# Altium schematic sheet DC-DC_Buck_Converter+12Vto+3.3V.SchDoc
size A4; SheetNumber: 3; SheetTotal: 10
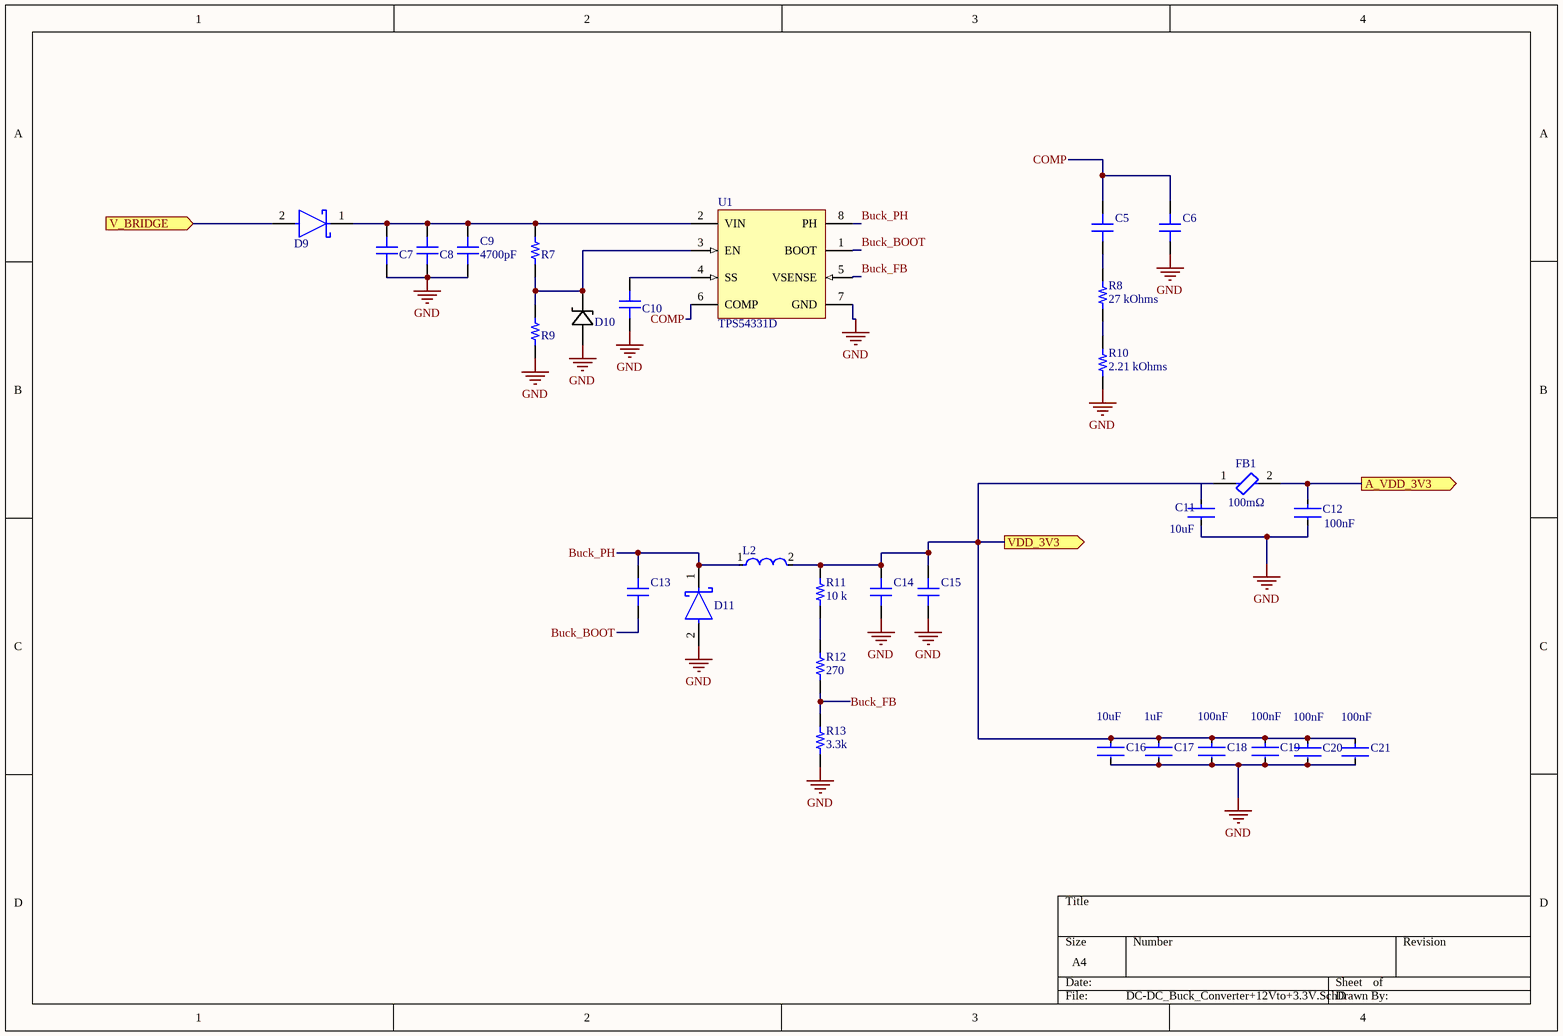
[diagram p0: DC-DC_Buck_Converter+12Vto+3.3V.SchDoc]

## Parts
C5  4700pF  [CAP 0603_1608]  (value not drawn)
C6  4700pF  [CAP 0603_1608]  (value not drawn)
C7  4700pF  [CAP 0603_1608]  (value not drawn)
C8  4700pF  [CAP 0603_1608]  (value not drawn)
C9  4700pF  [CAP 0603_1608]
C10  4700pF  [CAP 0603_1608]  (value not drawn)
C11  Capacitance: 10uF  [FP-GRM188-0_1-e0_2_0_55-IPC_A]  (hidden comment: GRM188R60J106ME47D)
C12  Capacitance: 100nF  [FP-GRM033-0_03-MFG]  (hidden comment: GRM033R60J104KE19D)
C13  1000pF  [CAP 0603_1608]  (value not drawn)
C14  1000pF  [CAP 0603_1608]  (value not drawn)
C15  1000pF  [CAP 0603_1608]  (value not drawn)
C16  Capacitance: 10uF  [FP-GRM188-0_1-e0_2_0_55-IPC_A]  (hidden comment: GRM188R60J106ME47D)
C17  value 1uF  [FP-GRM15-0_1-MFG]  (hidden comment: GRM155R61A105KE15D)
C18  Capacitance: 100nF  [FP-GRM033-0_03-MFG]  (hidden comment: GRM033R60J104KE19D)
C19  Capacitance: 100nF  [FP-GRM033-0_03-MFG]  (hidden comment: GRM033R60J104KE19D)
C20  Capacitance: 100nF  [FP-GRM033-0_03-MFG]  (hidden comment: GRM033R60J104KE19D)
C21  Capacitance: 100nF  [FP-GRM033-0_03-MFG]  (hidden comment: GRM033R60J104KE19D)
D9  SS34-E3/57T  [FP-95402-MFG]  (value not drawn)
D10  zmm3v3  [zmm5v6]  (value not drawn)
D11  SS34-E3/57T  [FP-95402-MFG]  (value not drawn)
FB1  Resistance: 100mΩ  [FP-MPZ2012-MFG]  (hidden comment: MPZ2012S601AT000)
L2  IHLP2525CZER6R8M01  [FP-IHLP-2525CZ-FP_2_413x3-MFG]  (value not drawn)
R7  15 kOhms  [RES 0805_2012]  (value not drawn)
R8  27 kOhms  [RES 0805_2012]
R9  15 kOhms  [RES 0805_2012]  (value not drawn)
R10  2.21 kOhms  [RES 0805_2012]
R11  10 k  [RES 0805_2012]
R12  270  [RES 0805_2012]
R13  3.3k  [RES 0805_2012]
U1  TPS54331D  [D0008A_L]

## Ports
A_VDD_3V3 (out, see MCU[1B]), V_BRIDGE (in, see DC_Current_Voltage_Measurement[3B], MotorDrivers[3C], Motors[1A], Power[4A]), VDD_3V3 (out, see ADC_Input_protection[3C], DC_Current_Voltage_Measurement[3B], MCU[1B], MotorDrivers[1A], MotorDrivers[1B], Power[1D], ZeroCrossing[1A])

## Nets
GND: C6.1 C7.1 C8.1 C9.1 C10.1 C11.2 C12.2 C14.2 C15.2 C16.2 C17.2 C18.2 C19.2 C20.2 C21.2 D10.2(ANODE) D11.2(A) R9.1 R10.1 R13.1 U1.7(GND)
A_VDD_3V3: C12.1 FB1.2 ; port A_VDD_3V3
Buck_BOOT: C13.2 U1.1(BOOT)
Buck_FB: R12.1 R13.2 U1.5(VSENSE)
Buck_PH: C13.1 D11.1(C) L2.1 U1.8(PH)
COMP: C5.2 C6.2 U1.6(COMP)
V_BRIDGE: D9.2(A) ; port V_BRIDGE
VDD_3V3: C11.1 C14.1 C15.1 C16.1 C17.1 C18.1 C19.1 C20.1 C21.1 FB1.1 L2.2 R11.2 ; port VDD_3V3
NetC5_1: C5.1 R8.2
NetC7_2: C7.2 C8.2 C9.2 D9.1(C) R7.2 U1.2(VIN)
NetC10_2: C10.2 U1.4(SS)
NetD10_1: D10.1(CATHODE) R7.1 R9.2 U1.3(EN)
NetR8_1: R8.1 R10.2
NetR11_1: R11.1 R12.2

## Library data of the parts
C5-C10 = 06035C472JAT2A: CAP CER 4700PF 50V X7R 0603; manufacturer: AVX Corporation; Tolerance: ±5%; Part Number: 06035C472JAT2A; Value: 4700pF; Applications: General Purpose; Capacitance: 4700pF; componentlink1description: Datasheet; componentlink1url: http://datasheets.avx.com/X7RDielectric.pdf; componentlink2description: DigiKey Link; componentlink2url: http://digikey.com/product-detail/en/avx-corporation/06035C472JAT2A/478-10355-1-ND/6797516; Device Package: 0603 (1608 Metric); lastupdated: 2.09.2020 01:03:35; Lifecycle Status: Active; Minimum Order: 1; Mounting Type: Surface Mount, MLCC; Operating Temperature: -55°C ~ 125°C; Package / Case: 0603 (1608 Metric); packaging: TapeAndReel; partid: 2778; Part Status: Active; price: 0.02; series: -; Size / Dimension: 0.063" L x 0.032" W (1.60mm x 0.81mm); Supplier 1: DigiKey; Supplier Part Number 1: 478-10355-1-ND; Temperature Coefficient: X7R; Thickness (Max): 0.035" (0.90mm); Voltage - Rated: 50V
C11 C16 = CMP-2006-02792-2: Chip Multilayer Ceramic Capacitors for General Purpose, 0603, 10uF, X5R, 15%, 20%, 6.3V; Packaging: Tape and Reel; Voltage Rating (DC): 6.3V; Width: 0.031inch; Termination: SMD/SMT; Dielectric: X5R; Package Quantity: 4000; Voltage Rating: 6.3V; Case/Package: 0603; Min Operating Temperature: -55°C; Voltage: 6.3V; Length: 1.6mm; Thickness: 0.035inch; Lead Free: Lead Free; Depth: 0.8mm; Case Code (Imperial): 0603; Max Operating Temperature: 85°C; Material: Ceramic; Height: 0.8mm; Tolerance: 20%; Mount: Surface Mount; REACH SVHC: No SVHC; Radiation Hardening: No; Case Code (Metric): 1608
C12 C18-C21 = CMP-06035-000062-2: Chip Multilayer Ceramic Capacitors for General Purpose, 0201, 0.10uF, X5R, 15%, 10%, 6.3V; Min Operating Temperature: -55°C; Lead Free: Lead Free; Radiation Hardening: No; Dielectric: X5R; Voltage Rating (DC): 6.3V; REACH SVHC: No SVHC; Case/Package: 0201; Voltage Rating: 6.3V; Length: 0.6mm; Max Operating Temperature: 85°C; Width: 0.012inch; Depth: 0.3mm; Material: Ceramic; Case Code (Metric): 0603; Thickness: 0.013inch; Packaging: Tape and Reel; Height: 0.3mm; Weight: 6E-06oz; Package Quantity: 1; Mount: Surface Mount; Voltage: 6.3V; Case Code (Imperial): 0201; Tolerance: 10%; Termination: SMD/SMT
C13-C15 = 0603ZC102KAT2A: CAP CER 1000PF 10V X7R 0603; manufacturer: AVX Corporation; Tolerance: ±10%; Part Number: 0603ZC102KAT2A; Value: 1000pF; Applications: General Purpose; Capacitance: 1000pF; componentlink1description: Datasheet; componentlink1url: http://datasheets.avx.com/X7RDielectric.pdf; componentlink2description: DigiKey Link; componentlink2url: http://digikey.com/product-detail/en/avx-corporation/0603ZC102KAT2A/478-0603ZC102KAT2ACT-ND/11570315; Device Package: 0603 (1608 Metric); lastupdated: 2.09.2020 01:02:55; Lifecycle Status: Active; Minimum Order: 1; Mounting Type: Surface Mount, MLCC; Operating Temperature: -55°C ~ 125°C; Package / Case: 0603 (1608 Metric); packaging: TapeAndReel; partid: 27370; Part Status: Active; price: 0.01; series: -; Supplier 1: DigiKey; Supplier Part Number 1: 478-0603ZC102KAT2ACT-ND; Temperature Coefficient: X7R; Voltage - Rated: 10V
C17 = CMP-2008-04556-2: CAP CER 1UF 10V X5R 0402; Manufacturer: Murata; Material: Ceramic; Tolerance: 10%; Temperature Coefficient: 15%; Octopart: https://octopart.com/grm155r61a105ke15d-murata-197442; Manufacturer Part Number: GRM155R61A105KE15D; Lead Free: Yes; ComponentLink2Description: Datasheet; Temperature: -55°C to +85°C; Temperature Range High: +85°C; Height: 0.55mm; Capacitance: 1uF; Ipc Land Pattern Name: CAPC10050X50; ComponentLink2URL: https://search.murata.co.jp/Ceramy/image/img/A01X/G101/ENG/GRM155R61A105KE15-01A.pdf; Temperature Range Low: -55°C; Device Class L2: Capacitors; Voltage Rating: 10V; RoHS: TRUE; Device Class L1: Passive Components; Device Class L3: Ceramic Capacitors; Temperature Characteristic: X5R; Mouser Description: 0402 1 uF 10 V ±10% Tolerance X5R Surface Mount Multilayer Ceramic Capacitor; Automotive: No; Package: GRM15-0.1; Digikey Description: CAP CER 1UF 10V X5R 0402; Category: Cap
D9 D11 = CMP-02539-000012-1: DIODE SCHOTTKY 40V 3A DO214AB; Manufacturer: Vishay; Max Junction Temp: +150°C; Peak Reverse Current: 0.5mA; Max Surge Forward Current: 100A; Standoff Height: 0mm; ComponentLink2Description: Datasheet; Device Class L3: Schottky Diodes; Height: 2.62mm; Max Repetitive Reverse Voltage: 40V; Lead Free: Yes; Package: 95402; Temperature Range High: +150°C; ComponentLink2URL: http://www.vishay.com/docs/88751/ss32.pdf; Temperature: -55°C to +150°C; Footprint Url: http://www.vishay.com/docs/95402/smc.pdf; Automotive: No; Forward Current: 3A; Category: Diode; Manufacturer Part Number: SS34-E3/57T; RoHS: TRUE; Device Class L2: Diodes; Mouser Description: Schottky Diodes & Rectifiers 3.0 Amp 40 Volt; Octopart: https://octopart.com/ss34-e3%2F57t-vishay-39552907; Temperature Range Low: -55°C; Device Class L1: Discrete Semiconductors; Digikey Description: DIODE SCHOTTKY 40V 3A DO214AB
D10 = zmm5v6
FB1 = CMP-2000-05401-2: Manufacturer Lifecycle Status: PRODUCTION; NexarPartId: 12090955; RMS Current (Irms): 2A; Test Frequency: 100MHz; Tolerance: 25%; Core Material: Ferrite; Impedance: 600Ω; Packaging: Digi-Reel®; Length: 2mm; Min Operating Temperature: -55°C; Width: 1.25mm; Max Width: 1.45mm; Lead Free: Lead Free; Current Rating: 2A; Case Code (Imperial): 0805; Min Length: 1.8mm; Schedule B: 8504500000, 8504500000; Series Resistance: 100mΩ; REACH SVHC: No SVHC; Case Code (Metric): 2012; Max DC Current: 2A; Case/Package: 0805; Lifecycle Status: Production; Min Width: 1.05mm; Mount: Surface Mount; Height: 1.0414mm; DC Resistance (DCR): 100mΩ; Max Operating Temperature: 125°C; Max Length: 2.2mm; RoHS: Compliant
L2 = CMP-02424-000104-1: Commercial Inductors, High Saturation Series 6.8uH 4.5A 60mΩ 20%; Saturation Current: 8A; Self Resonant Frequency: 5MHz; Core Material: Metal; DC Resistance (DCR): 60mR; Test Frequency: 100kHz; Shielding: Shielded; Number of Pins: 2; Tolerance: 20%; Max DC Current: 8A; Max Operating Temperature: 125°C; Radiation Hardening: No; Inductance: 6.8uH; Contact Plating: Tin; RMS Current (Irms): 4.5A; Case/Package: 2525; Inductance Tolerance: 20%; Case Code (Metric): 6363; Lead Free: Lead Free; Package Quantity: 2000; Current Rating: 4.5A; Case Code (Imperial): 2525; Height - Seated (Max): 0.118inch; Height: 3mm; Mount: Surface Mount; Depth: 6.72mm; Military Standard: Not; Packaging: Tape and Reel; Min Operating Temperature: -55°C; Width: 0.255inch; Length: 7.24mm; Termination: SMD/SMT
R7 R9 = PTN0805Y1502BST1: PTN0805 10PPM 15K 0.1% S T1 E1; Manufacturer: Vishay Dale Thin Film; Power (Watts): 0.2W, 1/5W; Temperature Coefficient: ±10ppm/°C; Part Number: PTN0805Y1502BST1; Value: 15 kOhms; ComponentLink1Description: Datasheet; ComponentLink1URL: https://www.vishay.com/docs/60026/ptn.pdf; ComponentLink2Description: DigiKey Link; ComponentLink2URL: https://www.digikey.com/en/products/detail/vishay-dale-thin-film/PTN0805Y1502BST1/12820709; Composition: Thin Film; Device Package: 0805 (2012 Metric); Features: Anti-Sulfur, Moisture Resistant, Non-Inductive; Height - Seated (Max): 0.033" (0.84mm); LastUpdated: 3.10.2023 19:53:28; Lifecycle Status: Active; Minimum Order: 1; Number of Terminations: 2; Operating Temperature: -55°C ~ 155°C; Package / Case: 0805 (2012 Metric); Packaging: TapeAndReel; PartId: 61260; Part Status: Active; Price: 0.29; Resistance: 15 kOhms; Series: PTN; Size / Dimension: 0.080" L x 0.050" W (2.03mm x 1.27mm); Supplier 1: DigiKey; Supplier Part Number 1: 764-PTN0805Y1502BST1CT-ND; Supplier Device Package: 0805; Tolerance: ±0.1%
R8 = RMCF0805FT27K0: RES 27K OHM 1% 1/8W 0805; Manufacturer: Stackpole Electronics Inc; Power (Watts): 0.125W, 1/8W; Temperature Coefficient: ±100ppm/°C; Part Number: RMCF0805FT27K0; Value: 27 kOhms; ComponentLink1Description: Datasheet; ComponentLink1URL: https://www.seielect.com/catalog/sei-packaging.pdf; ComponentLink2Description: DigiKey Link; ComponentLink2URL: https://www.digikey.com/en/products/detail/stackpole-electronics-inc/RMCF0805FT27K0/1712930; Composition: Thick Film; Device Package: 0805 (2012 Metric); Features: Automotive AEC-Q200; Height - Seated (Max): 0.026" (0.65mm); LastUpdated: 3.10.2023 19:54:39; Lifecycle Status: Active; Minimum Order: 1; Number of Terminations: 2; Operating Temperature: -55°C ~ 155°C; Package / Case: 0805 (2012 Metric); Packaging: CutTape; PartId: 38336; Part Status: Active; Price: 0.01; Ratings: AEC-Q200; Resistance: 27 kOhms; Series: RMCF; Size / Dimension: 0.079" L x 0.049" W (2.00mm x 1.25mm); Supplier 1: DigiKey; Supplier Part Number 1: RMCF0805FT27K0CT-ND; Supplier Device Package: 0805; Tolerance: ±1%
R10 = RMCF0805FG2K21: RES 2.21K OHM 1% 1/8W 0805; Manufacturer: Stackpole Electronics Inc; Power (Watts): 0.125W, 1/8W; Temperature Coefficient: ±100ppm/°C; Part Number: RMCF0805FG2K21; Value: 2.21 kOhms; ComponentLink1Description: Datasheet; ComponentLink1URL: https://www.seielect.com/catalog/sei-rmcf_rmcp.pdf; ComponentLink2Description: DigiKey Link; ComponentLink2URL: https://www.digikey.com/en/products/detail/stackpole-electronics-inc/RMCF0805FG2K21/1712795; Composition: Thick Film; Device Package: 0805 (2012 Metric); Features: Automotive AEC-Q200; Height - Seated (Max): 0.026" (0.65mm); LastUpdated: 3.10.2023 19:55:04; Lifecycle Status: Active; Minimum Order: 1; Number of Terminations: 2; Operating Temperature: -55°C ~ 155°C; Package / Case: 0805 (2012 Metric); Packaging: CutTape; PartId: 31688; Part Status: Active; Price: 0.01; Ratings: AEC-Q200; Resistance: 2.21 kOhms; Series: RMCF; Size / Dimension: 0.079" L x 0.049" W (2.00mm x 1.25mm); Supplier 1: DigiKey; Supplier Part Number 1: RMCF0805FG2K21CT-ND; Supplier Device Package: 0805; Tolerance: ±1%
R11-R13 = RMCF0805FT27K0: RES 27K OHM 1% 1/8W 0805; Manufacturer: Stackpole Electronics Inc; Power (Watts): 0.125W, 1/8W; Resistance: 27 kOhms; Temperature Coefficient: ±100ppm/°C; Part Number: RMCF0805FT27K0; ComponentLink1Description: Datasheet; ComponentLink1URL: https://www.seielect.com/catalog/sei-packaging.pdf; ComponentLink2Description: DigiKey Link; ComponentLink2URL: https://www.digikey.com/en/products/detail/stackpole-electronics-inc/RMCF0805FT27K0/1712930; Composition: Thick Film; Device Package: 0805 (2012 Metric); Features: Automotive AEC-Q200; Height - Seated (Max): 0.026" (0.65mm); LastUpdated: 3.10.2023 19:54:39; Lifecycle Status: Active; Minimum Order: 1; Number of Terminations: 2; Operating Temperature: -55°C ~ 155°C; Package / Case: 0805 (2012 Metric); Packaging: CutTape; PartId: 38336; Part Status: Active; Price: 0.01; Ratings: AEC-Q200; Series: RMCF; Size / Dimension: 0.079" L x 0.049" W (2.00mm x 1.25mm); Supplier 1: DigiKey; Supplier Part Number 1: RMCF0805FT27K0CT-ND; Supplier Device Package: 0805; Tolerance: ±1%
  R11: Value: 10 k
  R12: Value: 270
  R13: Value: 3.3k
U1 = CMP-0323-00203-3: Buck Step Down Regulator with 3.5 to 28 V Input and 0.8 to 25 V Output, -40 to 150 degC, 8-Pin SOIC (D), Green (RoHS & no Sb/Br); Manufacturer: Texas Instruments; Regulated Outputs(#): 1; Vout(Min)(V): 0.8; Iout(Max)(A): 3; Vin(Min)(V): 3.5; Rating: Catalog; SubFamily: Step-Down Regulator; Vout(Max)(V): 25; Iq(Typ)(mA): 0.11; Vin(Max)(V): 28; Duty Cycle(Max)(%): 90; ComponentLink3Description: URL Link1; ComponentLink1URL: http://www.ti.com/general/docs/lit/getliterature.tsp?genericPartNumber=TPS54331&fileType=pdf; Code_JEDEC: MS-012AA; PartNumber: TPS54331D; PackageVersion: revM, Jun-2011; ComponentLink1Description: Datasheet; PackageReference: D0008A; Eco-Plan: Green (RoHS & no Sb/Br); PackageDescription: 8-Pin Plastic Small Outline Integrated Circuit, 4.9 x 3.9 mm, Pitch 1.27 mm Pitch; ComponentLink2URL: http://www.ti.com/litv/pdf/msoi002j; DatasheetVersion: SLVS839D; Topology: Buck; Switch Current Limit(Typ)(A): 3.5; ComponentLink3URL: Samples URL:http://www.ti.com/product/tps54331#samples; ComponentLink2Description: Package Specification; Mounting Technology: Surface Mount